# EAGLE schematic EEGFrontOnly (EAGLE 8.6.0)

## Sheet 1 of 3
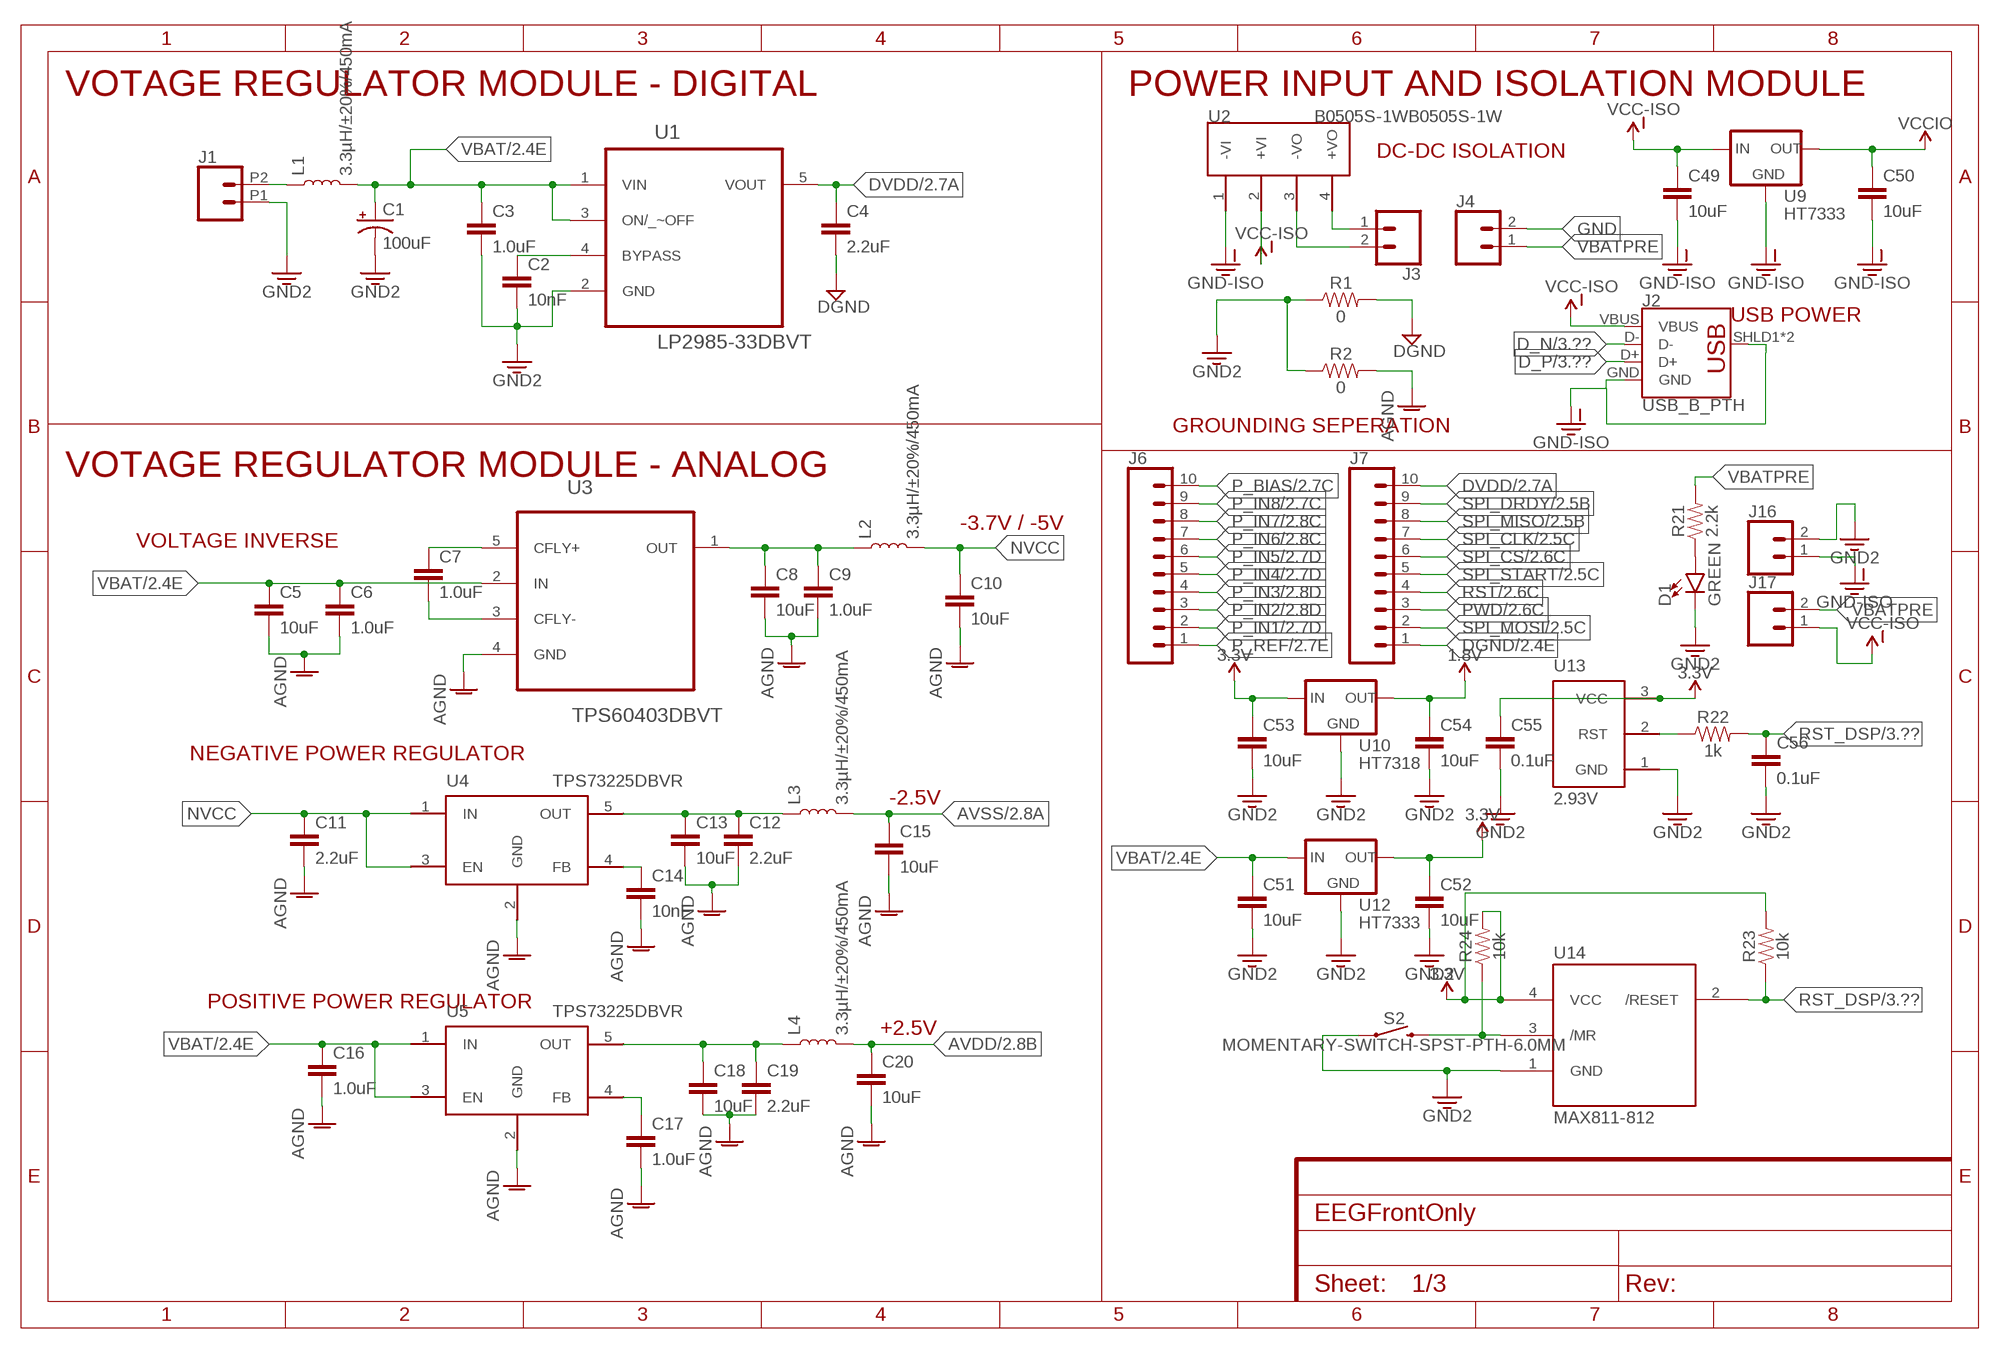
[diagram p0: schematic, sheet 1]

### Parts
C1  100uF  100UF-POLAR-RADIAL-2.5MM-25V-20%  [CPOL-RADIAL-2.5MM-6.5MM]
C2  10nF  10NF-0402-50V-10%  [0402]
C3  1.0uF  1.0UF-0402-16V-10%  [0402]
C4  2.2uF  2.2UF-0603-10V-20%  [0603]
C5  10uF  10UF-0603-6.3V-20%  [0603]
C6  1.0uF  1.0UF-0603-16V-10%  [0603]
C7  1.0uF  1.0UF-0402-16V-10%  [0402]
C8  10uF  10UF-0603-6.3V-20%  [0603]
C9  1.0uF  1.0UF-0603-16V-10%  [0603]
C10  10uF  10UF-0603-6.3V-20%  [0603]
C11  2.2uF  2.2UF-0603-10V-20%  [0603]
C12  2.2uF  2.2UF-0603-10V-20%  [0603]
C13  10uF  10UF-0603-6.3V-20%  [0603]
C14  10nF  10NF-0402-50V-10%  [0402]
C15  10uF  10UF-0603-6.3V-20%  [0603]
C16  1.0uF  1.0UF-0402-16V-10%  [0402]
C17  1.0uF  1.0UF-0402-16V-10%  [0402]
C18  10uF  10UF-0603-6.3V-20%  [0603]
C19  2.2uF  2.2UF-0603-10V-20%  [0603]
C20  10uF  10UF-0603-6.3V-20%  [0603]
C49  10uF  10UF-0603-6.3V-20%  [0603]
C50  10uF  10UF-0603-6.3V-20%  [0603]
C51  10uF  10UF-0603-6.3V-20%  [0603]
C52  10uF  10UF-0603-6.3V-20%  [0603]
C53  10uF  10UF-0603-6.3V-20%  [0603]
C54  10uF  10UF-0603-6.3V-20%  [0603]
C55  0.1uF  0.1UF-0402-16V-10%  [0402]
C56  0.1uF  0.1UF-0402-16V-10%  [0402]
D1  GREEN  LED-GREEN0603  [LED-0603]
J1  CONN_022.54MM_SCREWTERM  [1X02_2.54_SCREWTERM]
J2  USB_B_PTH  [USB-B-PTH]
J3  CONN_02  [1X02]
J4  CONN_02  [1X02]
J6  CONN_10"  [1X10]
J7  CONN_10"  [1X10]
J16  CONN_02  [1X02]
J17  CONN_02  [1X02]
L1  3.3µH/±20%/450mA  INDUCTOR-0805-3.3UH  [0805]
L2  3.3µH/±20%/450mA  INDUCTOR-0805-3.3UH  [0805]
L3  3.3µH/±20%/450mA  INDUCTOR-0805-3.3UH  [0805]
L4  3.3µH/±20%/450mA  INDUCTOR-0805-3.3UH  [0805]
R1  0  560OHM_0402_1%  [0402]
R2  0  560OHM_0402_1%  [0402]
R21  2.2k  2.2KOHM-0603-1/10W-1%  [0603]
R22  1k  1KOHM-0402-1%  [0402]
R23  10k  10KOHM-0402-1/10W-1%  [0402]
R24  10k  10KOHM-0402-1/10W-1%  [0402]
S2  MOMENTARY-SWITCH-SPST-PTH-6.0MM  [TACTILE_SWITCH_PTH_6.0MM]
U1  LP2985-33DBVT  [SOT95P280X145-5N]
U2  B0505S-1WB0505S-1W  [DIP4]
U3  TPS60403DBVT  [SOT95P280X145-5N]
U4  TPS73225DBVR  [SOT95P280X145-5N]
U5  TPS73225DBVR  [SOT95P280X145-5N]
U9  HT7333  [SOT-89]
U10  HT7318  [SOT-89]
U12  HT7333  [SOT-89]
U13  2.93V  IMP809SEUR-T  [SOT23-3]
U14  MAX811-812  [SOT143]

### Nets
1.8V: C54.1 U10.1(OUT) ; also sheet 3
3.3V: C52.1 C53.1 C55.1 R23.2 R24.2 U10.3(IN) U10.4(IN) U12.1(OUT) U13.3(VCC) U14.4(VCC) ; also sheet 3
AGND: C5.2 C6.2 C8.2 C9.2 C10.2 C11.2 C12.2 C13.2 C14.2 C15.2 C16.2 C17.2 C18.2 C19.2 C20.2 R2.2 U3.4(GND) U4.2(GND) U5.2(GND) ; also sheet 2
AVDD: C20.1 L4.2 ; also sheet 2
AVSS: C15.1 L3.2 ; also sheet 2
BYPASS: C2.1 U1.4(BYPASS)
D_N: J2.D- ; also sheet 3
D_P: J2.D+ ; also sheet 3
DGND: C4.2 J7.1 R1.2 ; also sheet 2
DVDD: C4.1 J7.10 U1.5(VOUT) ; also sheet 2
GND: C1.2(-) C2.2 C3.2 C51.2 C52.2 C53.2 C54.2 C55.2 C56.2 D1.C J1.P1 J4.2 J16.2 R1.1 R2.1 S2.1 U1.2(GND) U10.2(GND) U12.2(GND) U13.1(GND) U14.1(GND) ; supply symbol labelled GND2 ; also sheet 3
GND-ISO: C49.2 C50.2 J2.GND J2.SHLD1(SHIELD) J2.SHLD2(SHIELD) J16.1 U2.1(-VI) U9.2(GND) ; also sheet 3
N$1: J3.1 U2.4(+VO)
N$2: J3.2 U2.3(-VO)
N$3: C7.1 U3.5(CFLY+)
N$4: C7.2 U3.3(CFLY-)
N$5: C8.1 C9.1 L2.1 U3.1(OUT)
N$6: C17.1 U5.4(FB)
N$7: C12.1 C13.1 L3.1 U4.5(OUT)
N$8: C14.1 U4.4(FB)
N$9: C18.1 C19.1 L4.1 U5.5(OUT)
N$27: D1.A R21.1
N$28: R24.1 S2.3 U14.3(/MR)
N$29: R22.1 U13.2(RST)
NVCC: C10.1 C11.1 L2.2 U4.1(IN) U4.3(EN)
P_BIAS: J6.10 ; also sheet 2
P_IN1: J6.2 ; also sheet 2
P_IN2: J6.3 ; also sheet 2
P_IN3: J6.4 ; also sheet 2
P_IN4: J6.5 ; also sheet 2
P_IN5: J6.6 ; also sheet 2
P_IN6: J6.7 ; also sheet 2
P_IN7: J6.8 ; also sheet 2
P_IN8: J6.9 ; also sheet 2
P_REF: J6.1 ; also sheet 2
PWD: J7.3 ; also sheet 2,3
RST: J7.4 ; also sheet 2,3
RST_DSP: C56.1 R22.2 R23.1 U14.2(/RESET) ; also sheet 3
SPI_CLK: J7.7 ; also sheet 2,3
SPI_CS: J7.6 ; also sheet 2,3
SPI_DRDY: J7.9 ; also sheet 2,3
SPI_MISO: J7.8 ; also sheet 2,3
SPI_MOSI: J7.2 ; also sheet 2,3
SPI_START: J7.5 ; also sheet 2,3
VBAT: C1.1(+) C3.1 C5.1 C6.1 C16.1 C51.1 L1.2 U1.1(VIN) U1.3(ON/_~OFF) U3.2(IN) U5.1(IN) U5.3(EN) U12.3(IN) U12.4(IN) ; also sheet 2,3
VBATPRE: J1.P2 J4.1 J17.2 L1.1 R21.2
VCC-ISO: C49.1 J2.VBUS J17.1 U2.2(+VI) U9.3(IN) U9.4(IN) ; also sheet 3
VCCIO: C50.1 U9.1(OUT) ; also sheet 3

### Notes on the sheet
- VOTAGE REGULATOR MODULE - DIGITAL | POWER INPUT AND ISOLATION MODULE
- DC-DC ISOLATION
- USB POWER
- GROUNDING SEPERATION
- VOTAGE REGULATOR MODULE - ANALOG
- -3.7V / -5V
- VOLTAGE INVERSE
- NEGATIVE POWER REGULATOR
- -2.5V
- POSITIVE POWER REGULATOR
- +2.5V

## Sheet 2 of 3
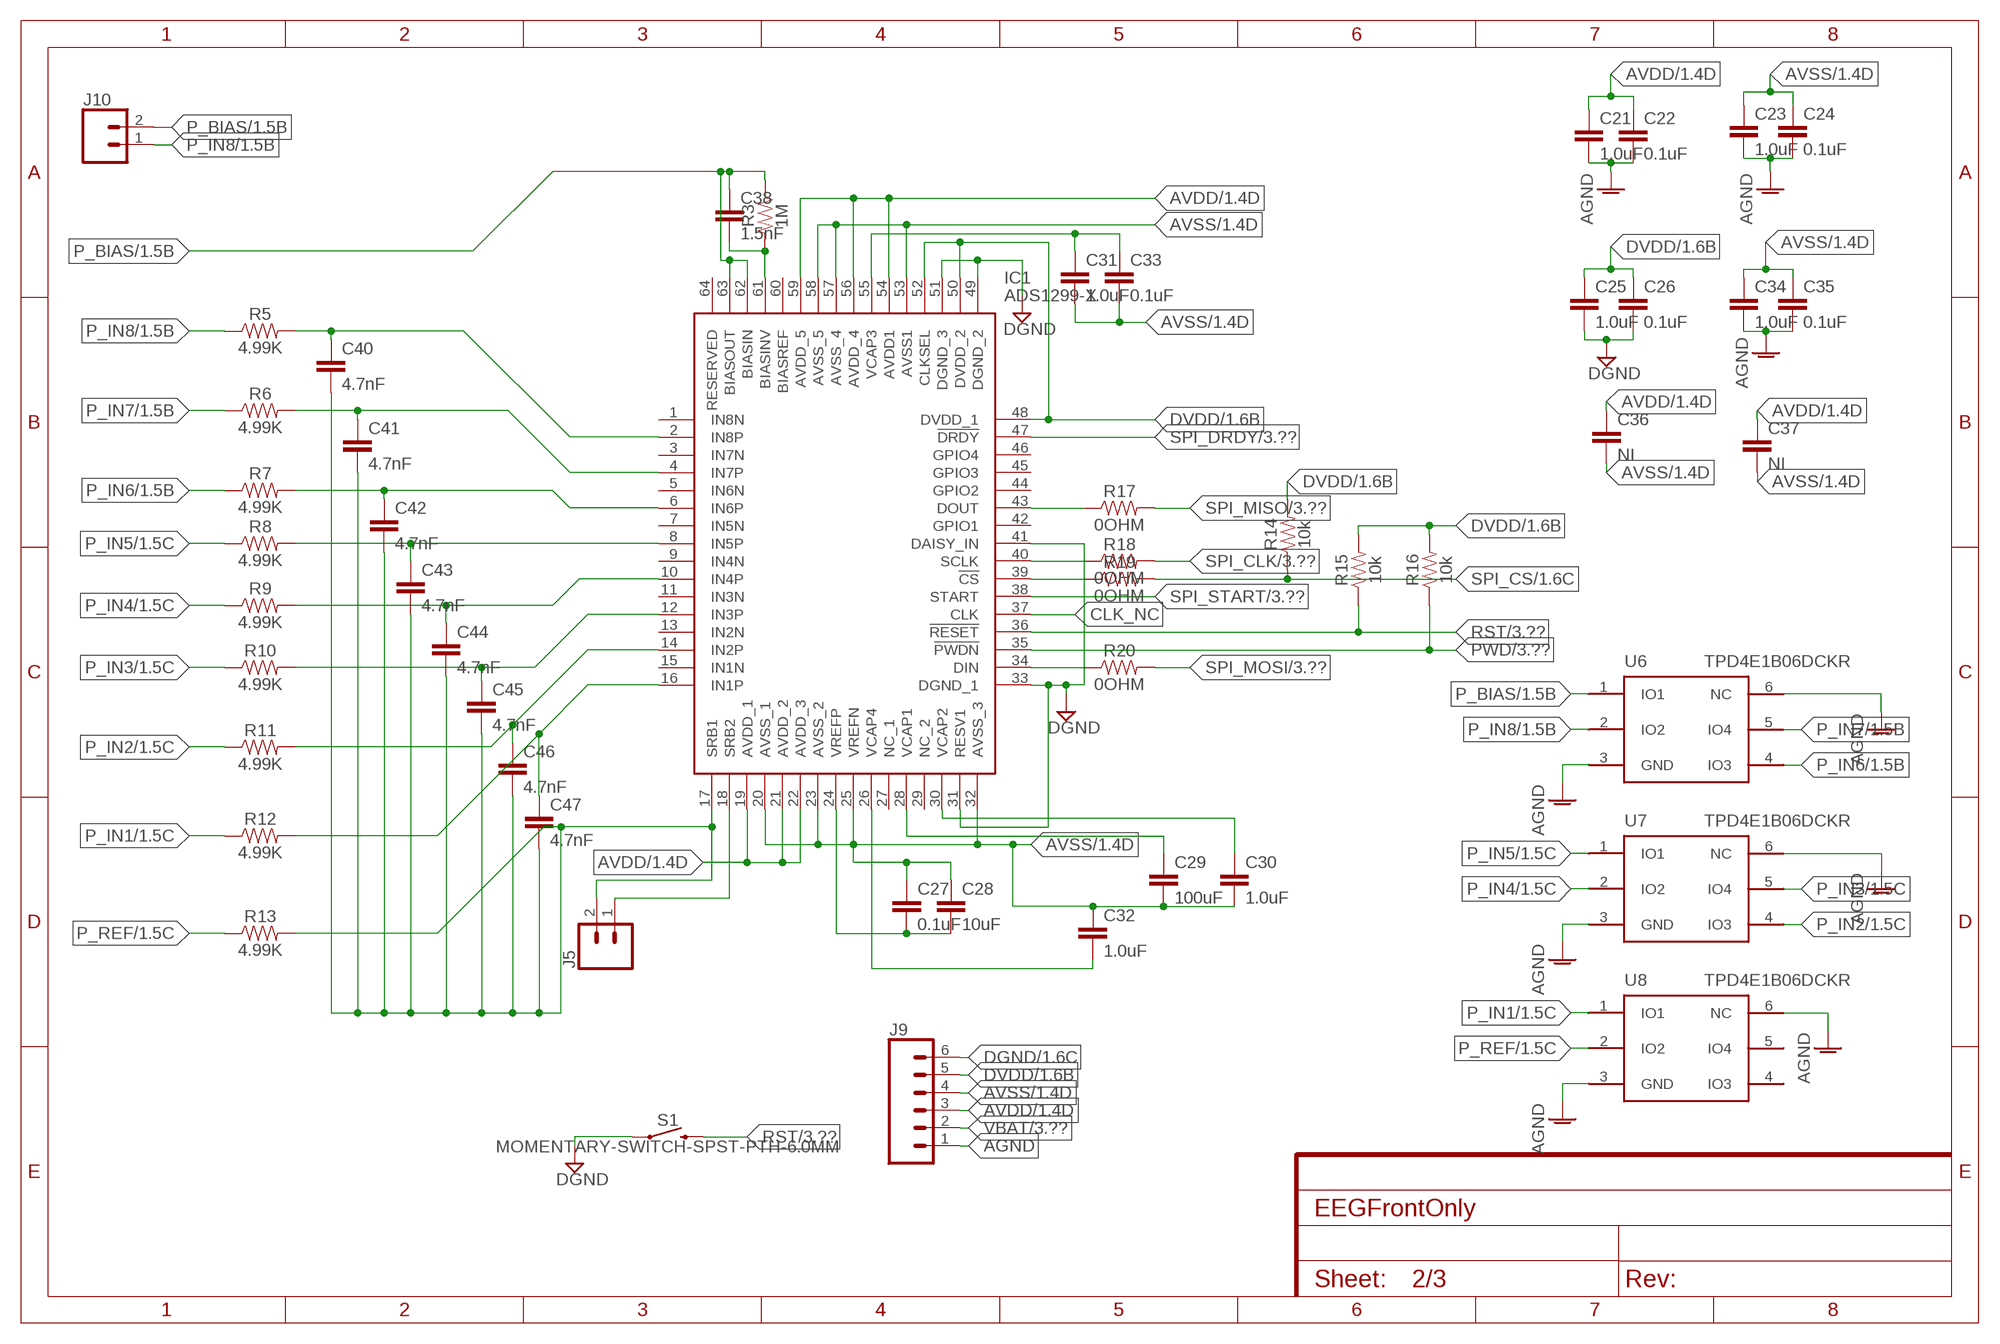
[diagram p1: schematic, sheet 2]

### Parts
C21  1.0uF  1.0UF-0402-16V-10%  [0402]
C22  0.1uF  0.1UF-0402-16V-10%  [0402]
C23  1.0uF  1.0UF-0402-16V-10%  [0402]
C24  0.1uF  0.1UF-0402-16V-10%  [0402]
C25  1.0uF  1.0UF-0402-16V-10%  [0402]
C26  0.1uF  0.1UF-0402-16V-10%  [0402]
C27  0.1uF  0.1UF-0402-16V-10%  [0402]
C28  10uF  10UF-0402-6.3V-20%  [0402]
C29  100uF  100UF-1210-20%-10V  [1210]
C30  1.0uF  1.0UF-0402-16V-10%  [0402]
C31  1.0uF  1.0UF-0402-16V-10%  [0402]
C32  1.0uF  1.0UF-0402-16V-10%  [0402]
C33  0.1uF  0.1UF-0402-16V-10%  [0402]
C34  1.0uF  1.0UF-0402-16V-10%  [0402]
C35  0.1uF  0.1UF-0402-16V-10%  [0402]
C36  NI  0.1UF-0402-16V-10%  [0402]
C37  NI  0.1UF-0402-16V-10%  [0402]
C38  1.5nF  1.5NF-0402  [0402]
C40  4.7nF  4.7NF-0402  [0402]
C41  4.7nF  4.7NF-0402  [0402]
C42  4.7nF  4.7NF-0402  [0402]
C43  4.7nF  4.7NF-0402  [0402]
C44  4.7nF  4.7NF-0402  [0402]
C45  4.7nF  4.7NF-0402  [0402]
C46  4.7nF  4.7NF-0402  [0402]
C47  4.7nF  4.7NF-0402  [0402]
IC1  ADS1299-X  [QFP50P1200X1200X120-64N]
J5  CONN_02  [1X02]
J9  CONN_06SILK_FEMALE_PTH  [1X06]
J10  CONN_02  [1X02]
R3  1M  1MOHM-0402-1/4W-5%  [0402]
R5  4.99K  4.99KOHM-0402  [0402]
R6  4.99K  4.99KOHM-0402  [0402]
R7  4.99K  4.99KOHM-0402  [0402]
R8  4.99K  4.99KOHM-0402  [0402]
R9  4.99K  4.99KOHM-0402  [0402]
R10  4.99K  4.99KOHM-0402  [0402]
R11  4.99K  4.99KOHM-0402  [0402]
R12  4.99K  4.99KOHM-0402  [0402]
R13  4.99K  4.99KOHM-0402  [0402]
R14  10k  10KOHM-0402-1/10W-1%  [0402]
R15  10k  10KOHM-0402-1/10W-1%  [0402]
R16  10k  10KOHM-0402-1/10W-1%  [0402]
R17  0OHM  [0402]
R18  0OHM  [0402]
R19  0OHM  [0402]
R20  0OHM  [0402]
S1  MOMENTARY-SWITCH-SPST-PTH-6.0MM  [TACTILE_SWITCH_PTH_6.0MM]
U6  TPD4E1B06DCKR  [SC70-6]
U7  TPD4E1B06DCKR  [SC70-6]
U8  TPD4E1B06DCKR  [SC70-6]

### Nets
AGND: C21.2 C22.2 C23.2 C24.2 C34.2 C35.2 J9.1 U6.3(GND) U6.6(NC) U7.3(GND) U7.6(NC) U8.3(GND) U8.6(NC) ; also sheet 1
AVDD: C21.1 C22.1 C36.1 C37.1 IC1.19(AVDD_1) IC1.21(AVDD_2) IC1.22(AVDD_3) IC1.54(AVDD1) IC1.56(AVDD_4) IC1.59(AVDD_5) J9.3 ; also sheet 1
AVSS: C23.1 C24.1 C27.1 C28.1 C29.2 C30.2 C31.2 C32.1 C33.2 C34.1 C35.1 C36.2 C37.2 IC1.20(AVSS_1) IC1.23(AVSS_2) IC1.25(VREFN) IC1.32(AVSS_3) IC1.53(AVSS1) IC1.57(AVSS_4) IC1.58(AVSS_5) J9.4 ; also sheet 1
CLK_NC: IC1.37(CLK)
DGND: C25.2 C26.2 IC1.31(RESV1) IC1.33(DGND_1) IC1.41(DAISY_IN) IC1.49(DGND_2) IC1.51(DGND_3) J9.6 S1.1 ; also sheet 1
DVDD: C25.1 C26.1 IC1.48(DVDD_1) IC1.50(DVDD_2) IC1.52(CLKSEL) J9.5 R14.2 R15.2 R16.2 ; also sheet 1
EEG_REF: C40.2 C41.2 C42.2 C43.2 C44.2 C45.2 C46.2 C47.2 IC1.17(SRB1) J5.2 R13.2
N$10: C27.2 C28.2 IC1.24(VREFP)
N$11: IC1.18(SRB2) J5.1
N$13: C38.2 IC1.61(BIASINV) R3.1
N$15: C40.1 IC1.2(IN8P) R5.2
N$16: C41.1 IC1.4(IN7P) R6.2
N$17: C42.1 IC1.6(IN6P) R7.2
N$18: C43.1 IC1.8(IN5P) R8.2
N$19: C44.1 IC1.10(IN4P) R9.2
N$20: C45.1 IC1.12(IN3P) R10.2
N$21: C46.1 IC1.14(IN2P) R11.2
N$22: C47.1 IC1.16(IN1P) R12.2
N$23: IC1.43(DOUT) R17.1
N$24: IC1.40(SCLK) R18.1
N$25: IC1.39(!CS) R19.1
N$26: IC1.34(DIN) R20.1
P_BIAS: C38.1 IC1.62(BIASIN) IC1.63(BIASOUT) J10.2 R3.2 U6.1(IO1) ; also sheet 1
P_IN1: R12.1 U8.1(IO1) ; also sheet 1
P_IN2: R11.1 U7.4(IO3) ; also sheet 1
P_IN3: R10.1 U7.5(IO4) ; also sheet 1
P_IN4: R9.1 U7.2(IO2) ; also sheet 1
P_IN5: R8.1 U7.1(IO1) ; also sheet 1
P_IN6: R7.1 U6.4(IO3) ; also sheet 1
P_IN7: R6.1 U6.5(IO4) ; also sheet 1
P_IN8: J10.1 R5.1 U6.2(IO2) ; also sheet 1
P_REF: R13.1 U8.2(IO2) ; also sheet 1
PWD: IC1.35(!PWDN) R16.1 ; also sheet 1,3
RST: IC1.36(!RESET) R15.1 S1.3 ; also sheet 1,3
SPI_CLK: R18.2 ; also sheet 1,3
SPI_CS: R14.1 R19.2 ; also sheet 1,3
SPI_DRDY: IC1.47(!DRDY) ; also sheet 1,3
SPI_MISO: R17.2 ; also sheet 1,3
SPI_MOSI: R20.2 ; also sheet 1,3
SPI_START: IC1.38(START) ; also sheet 1,3
VBAT: J9.2 ; also sheet 1,3
VCAP1: C29.1 IC1.28(VCAP1)
VCAP2: C30.1 IC1.30(VCAP2)
VCAP3: C31.1 C33.1 IC1.55(VCAP3)
VCAP4: C32.2 IC1.26(VCAP4)
Unconnected: IC1.1(IN8N) IC1.3(IN7N) IC1.5(IN6N) IC1.7(IN5N) IC1.9(IN4N) IC1.11(IN3N) IC1.13(IN2N) IC1.15(IN1N) IC1.27(NC_1) IC1.29(NC_2) IC1.42(GPIO1) IC1.44(GPIO2) IC1.45(GPIO3) IC1.46(GPIO4) IC1.60(BIASREF) IC1.64(RESERVED) U8.4(IO3) U8.5(IO4)

## Sheet 3 of 3
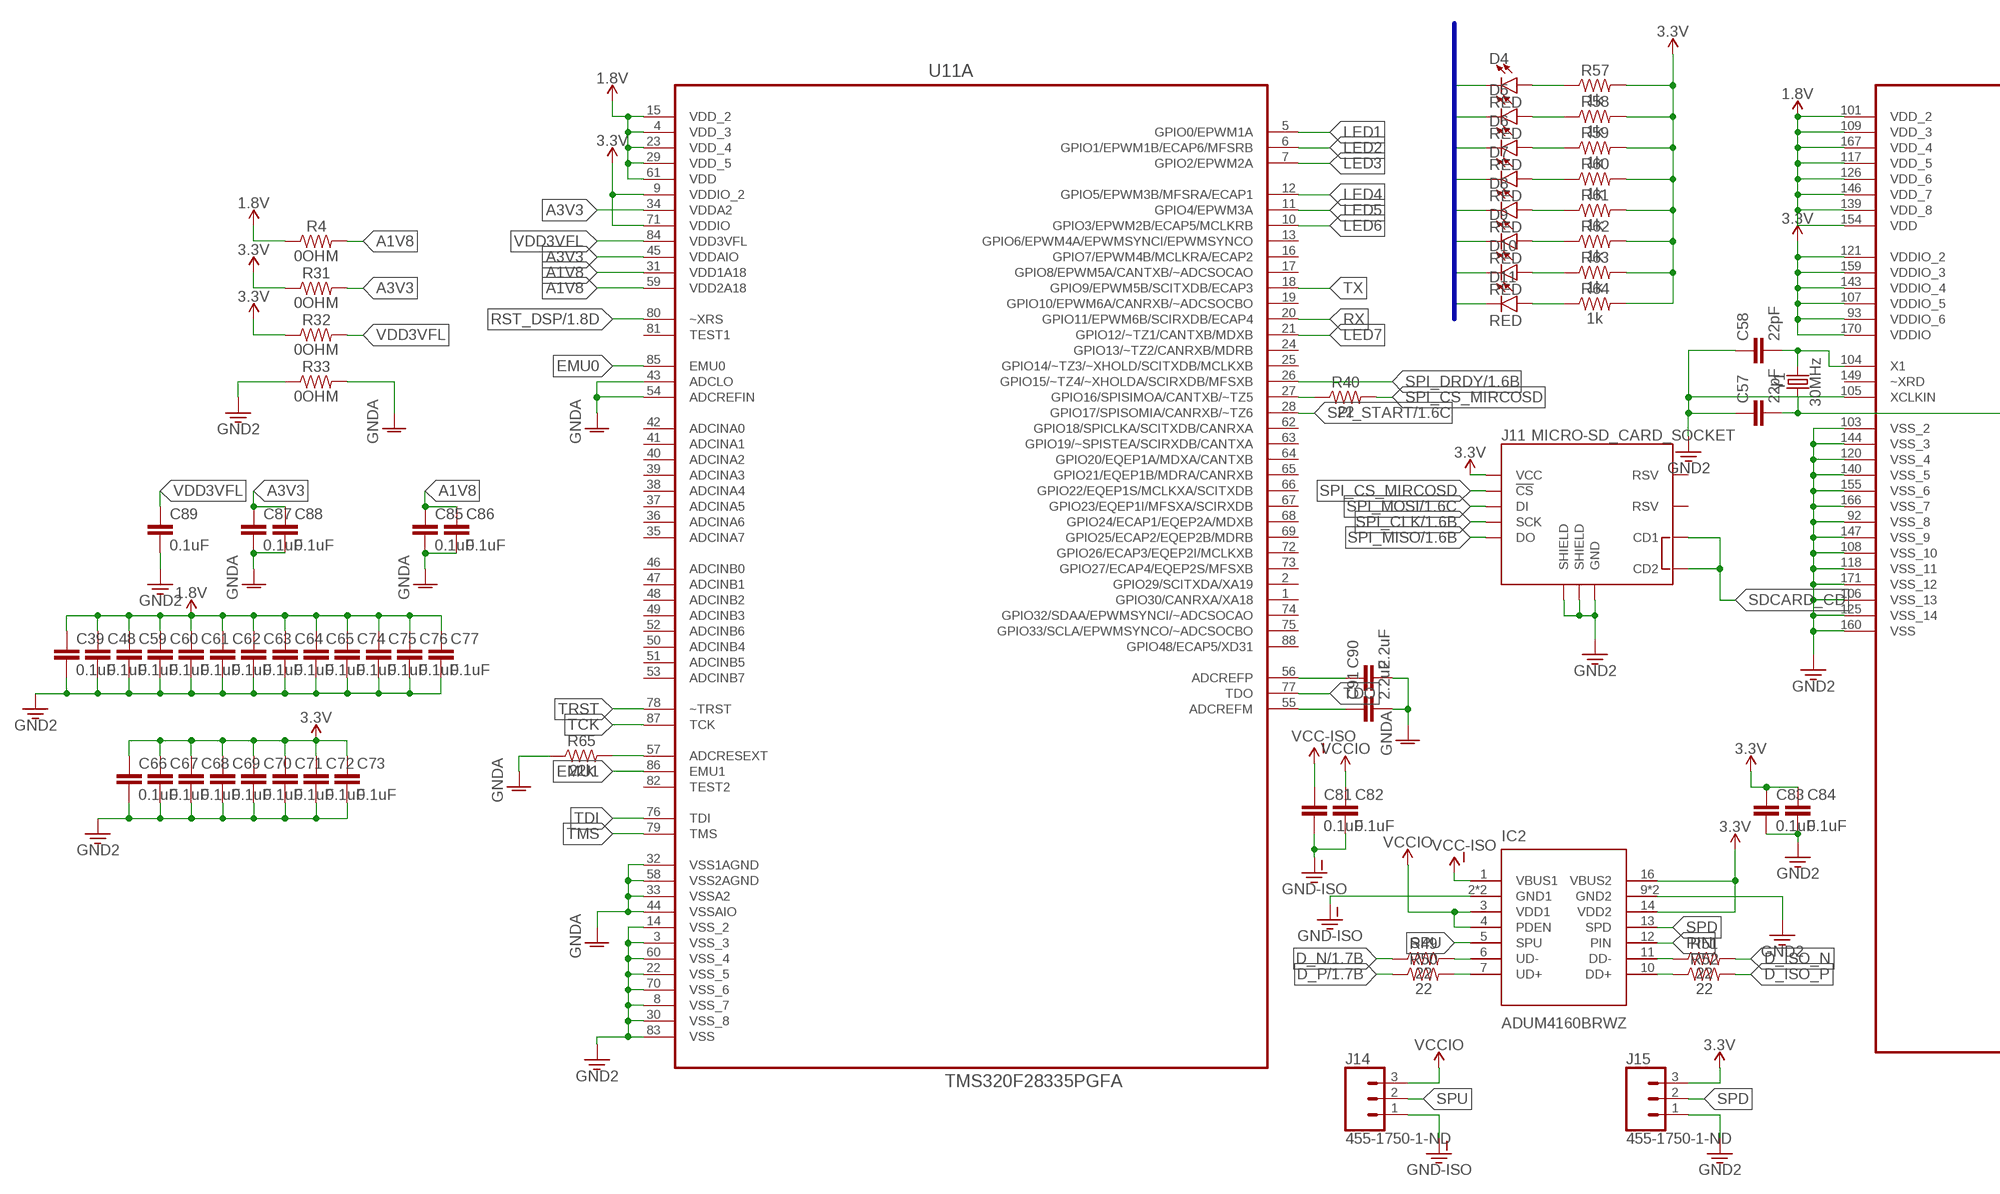
[diagram p2: schematic, sheet 3, part 1 of 2]
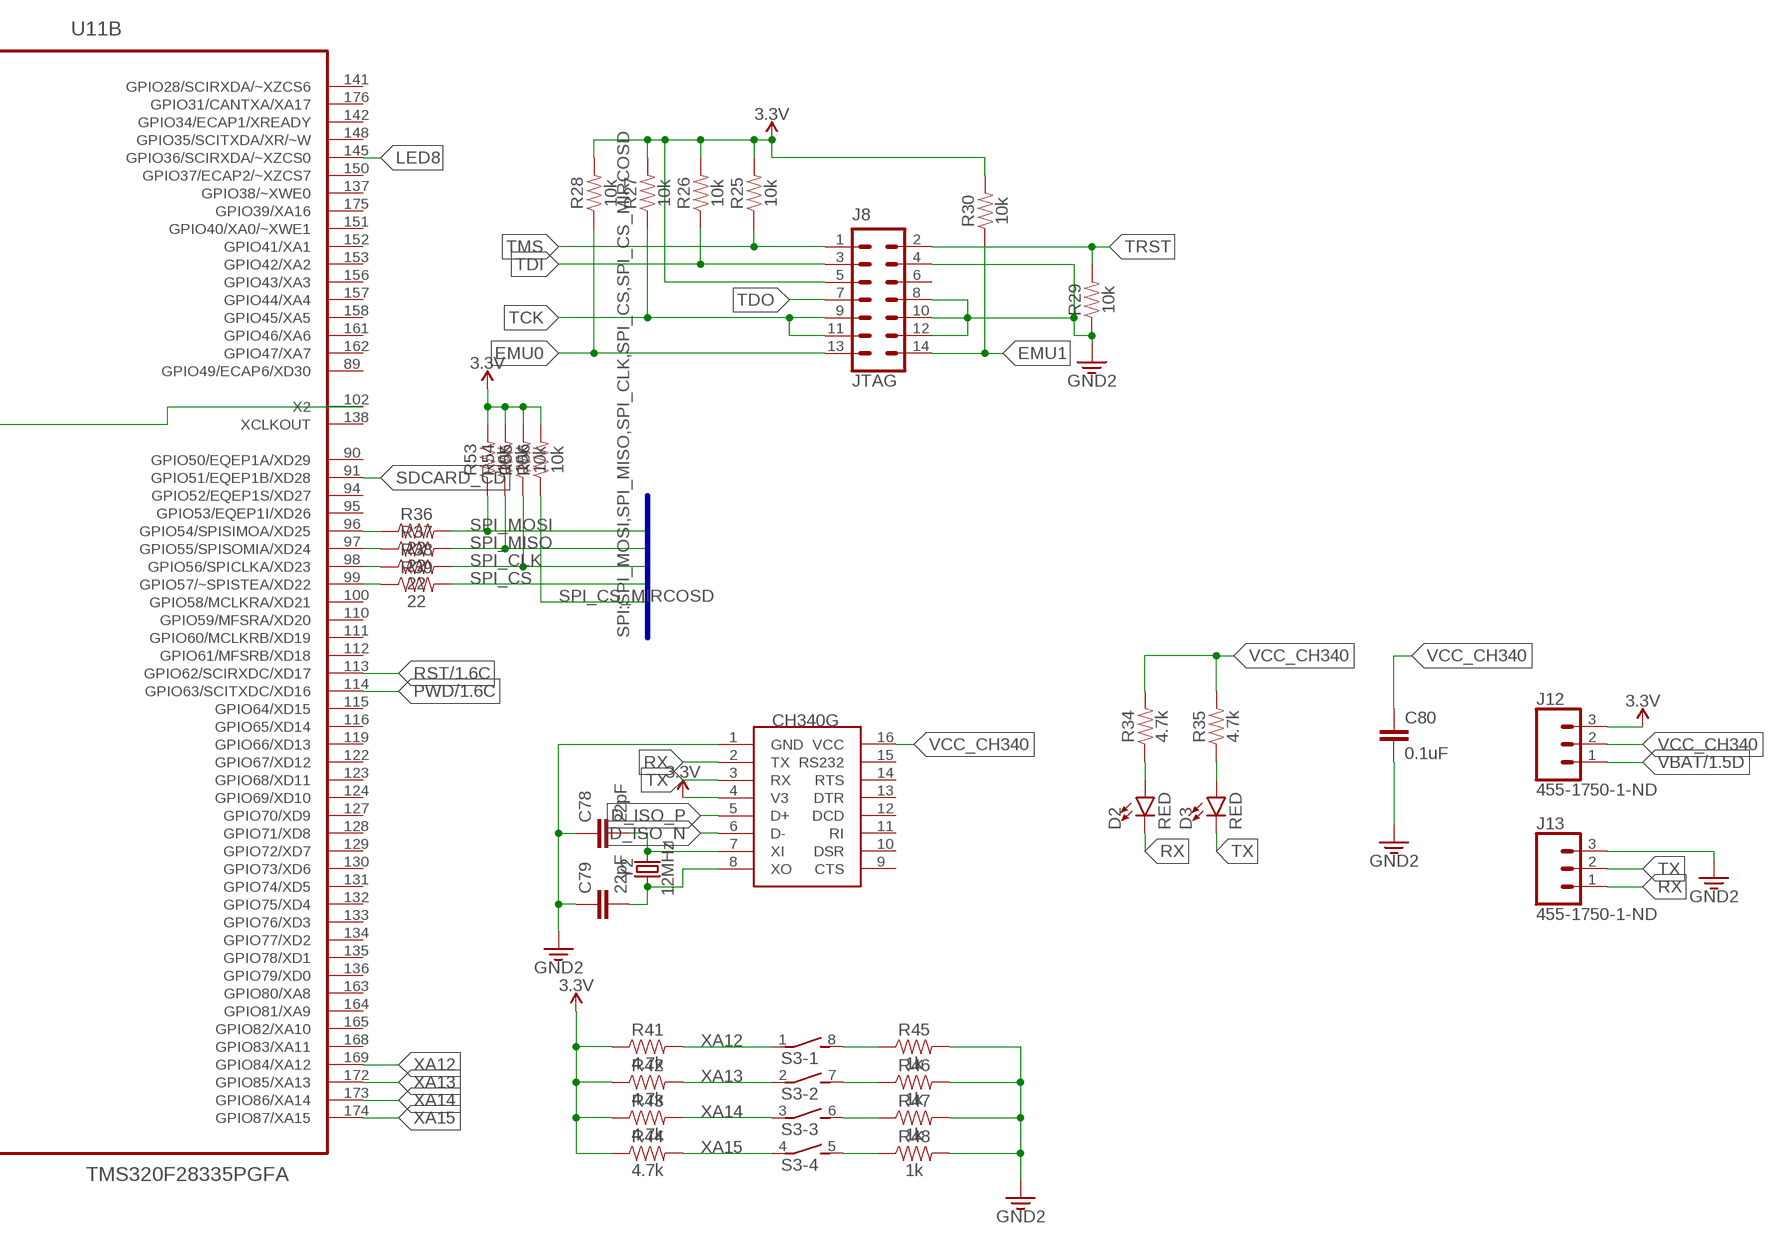
[diagram p3: schematic, sheet 3, part 2 of 2]

### Parts
C39  0.1uF  0.1UF-0402-16V-10%  [0402]
C48  0.1uF  0.1UF-0402-16V-10%  [0402]
C57  22pF  22PF-0402-50V-5%  [0402]
C58  22pF  22PF-0402-50V-5%  [0402]
C59  0.1uF  0.1UF-0402-16V-10%  [0402]
C60  0.1uF  0.1UF-0402-16V-10%  [0402]
C61  0.1uF  0.1UF-0402-16V-10%  [0402]
C62  0.1uF  0.1UF-0402-16V-10%  [0402]
C63  0.1uF  0.1UF-0402-16V-10%  [0402]
C64  0.1uF  0.1UF-0402-16V-10%  [0402]
C65  0.1uF  0.1UF-0402-16V-10%  [0402]
C66  0.1uF  0.1UF-0402-16V-10%  [0402]
C67  0.1uF  0.1UF-0402-16V-10%  [0402]
C68  0.1uF  0.1UF-0402-16V-10%  [0402]
C69  0.1uF  0.1UF-0402-16V-10%  [0402]
C70  0.1uF  0.1UF-0402-16V-10%  [0402]
C71  0.1uF  0.1UF-0402-16V-10%  [0402]
C72  0.1uF  0.1UF-0402-16V-10%  [0402]
C73  0.1uF  0.1UF-0402-16V-10%  [0402]
C74  0.1uF  0.1UF-0402-16V-10%  [0402]
C75  0.1uF  0.1UF-0402-16V-10%  [0402]
C76  0.1uF  0.1UF-0402-16V-10%  [0402]
C77  0.1uF  0.1UF-0402-16V-10%  [0402]
C78  22pF  22PF-0402-50V-5%  [0402]
C79  22pF  22PF-0402-50V-5%  [0402]
C80  0.1uF  0.1UF-0402-16V-10%  [0402]
C81  0.1uF  0.1UF-0402-16V-10%  [0402]
C82  0.1uF  0.1UF-0402-16V-10%  [0402]
C83  0.1uF  0.1UF-0402-16V-10%  [0402]
C84  0.1uF  0.1UF-0402-16V-10%  [0402]
C85  0.1uF  0.1UF-0402-16V-10%  [0402]
C86  0.1uF  0.1UF-0402-16V-10%  [0402]
C87  0.1uF  0.1UF-0402-16V-10%  [0402]
C88  0.1uF  0.1UF-0402-16V-10%  [0402]
C89  0.1uF  0.1UF-0402-16V-10%  [0402]
C90  2.2uF  2.2UF-0402-10V-20%  [0402]
C91  2.2uF  2.2UF-0402-10V-20%  [0402]
D2  RED  LED-RED0603  [LED-0603]
D3  RED  LED-RED0603  [LED-0603]
D4  RED  LED-RED0603  [LED-0603]
D5  RED  LED-RED0603  [LED-0603]
D6  RED  LED-RED0603  [LED-0603]
D7  RED  LED-RED0603  [LED-0603]
D8  RED  LED-RED0603  [LED-0603]
D9  RED  LED-RED0603  [LED-0603]
D10  RED  LED-RED0603  [LED-0603]
D11  RED  LED-RED0603  [LED-0603]
IC2  ADUM4160BRWZ  [SOIC127P1032X265-16N]
J8  JTAG  CONN_07X2  [2X7]
J11  MICRO-SD_CARD_SOCKET  [MICRO-SD-SOCKET]
J12  455-1750-1-ND  CONN_03  [1X03]
J13  455-1750-1-ND  CONN_03  [1X03]
J14  455-1750-1-ND  CONN_03  [1X03]
J15  455-1750-1-ND  CONN_03  [1X03]
R4  0OHM  [0402]
R25  10k  10KOHM-0402-1/10W-1%  [0402]
R26  10k  10KOHM-0402-1/10W-1%  [0402]
R27  10k  10KOHM-0402-1/10W-1%  [0402]
R28  10k  10KOHM-0402-1/10W-1%  [0402]
R29  10k  10KOHM-0402-1/10W-1%  [0402]
R30  10k  10KOHM-0402-1/10W-1%  [0402]
R31  0OHM  [0402]
R32  0OHM  [0402]
R33  0OHM  [0402]
R34  4.7k  4.7KOHM-0402-1/10W-1%  [0402]
R35  4.7k  4.7KOHM-0402-1/10W-1%  [0402]
R36  22  22OHM-0402-1/10W-1%  [0402]
R37  22  22OHM-0402-1/10W-1%  [0402]
R38  22  22OHM-0402-1/10W-1%  [0402]
R39  22  22OHM-0402-1/10W-1%  [0402]
R40  22  22OHM-0402-1/10W-1%  [0402]
R41  4.7k  4.7KOHM-0402-1/10W-1%  [0402]
R42  4.7k  4.7KOHM-0402-1/10W-1%  [0402]
R43  4.7k  4.7KOHM-0402-1/10W-1%  [0402]
R44  4.7k  4.7KOHM-0402-1/10W-1%  [0402]
R45  1k  1KOHM-0402-1%  [0402]
R46  1k  1KOHM-0402-1%  [0402]
R47  1k  1KOHM-0402-1%  [0402]
R48  1k  1KOHM-0402-1%  [0402]
R49  22  22OHM-0402-1/10W-1%  [0402]
R50  22  22OHM-0402-1/10W-1%  [0402]
R51  22  22OHM-0402-1/10W-1%  [0402]
R52  22  22OHM-0402-1/10W-1%  [0402]
R53  10k  10KOHM-0402-1/10W-1%  [0402]
R54  10k  10KOHM-0402-1/10W-1%  [0402]
R55  10k  10KOHM-0402-1/10W-1%  [0402]
R56  10k  10KOHM-0402-1/10W-1%  [0402]
R57  1k  1KOHM-0402-1%  [0402]
R58  1k  1KOHM-0402-1%  [0402]
R59  1k  1KOHM-0402-1%  [0402]
R60  1k  1KOHM-0402-1%  [0402]
R61  1k  1KOHM-0402-1%  [0402]
R62  1k  1KOHM-0402-1%  [0402]
R63  1k  1KOHM-0402-1%  [0402]
R64  1k  1KOHM-0402-1%  [0402]
R65  22k  22KOHM0402-1/10W-1%  [0402]
S3  DIP04S  [DIP04S]
U11  TMS320F28335PGFA  [QFP50P2600X2600X160-176N]
U$3  CH340G  [SOIC16]
Y1  30MHz  CRYSTALSMD-3.2X2.5  [CRYSTAL-SMD-3.2X2.5MM]
Y2  12MHz  CRYSTALSMD-3.2X2.5  [CRYSTAL-SMD-3.2X2.5MM]

### Nets
1.8V: C39.1 C48.1 C59.1 C60.1 C61.1 C62.1 C63.1 C64.1 C65.1 C74.1 C75.1 C76.1 C77.1 R4.1 U11.4(A:VDD_3) U11.15(A:VDD_2) U11.23(A:VDD_4) U11.29(A:VDD_5) U11.61(A:VDD) U11.101(B:VDD_2) U11.109(B:VDD_3) U11.117(B:VDD_5) U11.126(B:VDD_6) U11.139(B:VDD_8) U11.146(B:VDD_7) U11.154(B:VDD) U11.167(B:VDD_4) ; also sheet 1
3.3V: C66.1 C67.1 C68.1 C69.1 C70.1 C71.1 C72.1 C73.1 C83.1 C84.1 IC2.14(VDD2) IC2.16(VBUS2) J8.5 J11.VCC J12.3 J15.3 R25.2 R26.2 R27.2 R28.2 R30.2 R31.1 R32.1 R41.1 R42.1 R43.1 R44.1 R53.2 R54.2 R55.2 R56.2 R57.2 R58.2 R59.2 R60.2 R61.2 R62.2 R63.2 R64.2 U11.9(A:VDDIO_2) U11.71(A:VDDIO) U11.93(B:VDDIO_6) U11.107(B:VDDIO_5) U11.121(B:VDDIO_2) U11.143(B:VDDIO_4) U11.159(B:VDDIO_3) U11.170(B:VDDIO) U$3.4(V3) ; also sheet 1
A1V8: C85.1 C86.1 R4.2 U11.31(A:VDD1A18) U11.59(A:VDD2A18)
A3V3: C87.1 C88.1 R31.2 U11.34(A:VDDA2) U11.45(A:VDDAIO)
D_ISO_N: R51.2 U$3.6(D-)
D_ISO_P: R52.2 U$3.5(D+)
D_ISO_PRE_N: IC2.11(DD-) R51.1
D_ISO_PRE_P: IC2.10(DD+) R52.1
D_N: R49.1 ; also sheet 1
D_P: R50.1 ; also sheet 1
EMU0: J8.13 R28.1 U11.85(A:EMU0)
EMU1: J8.14 R30.1 U11.86(A:EMU1)
GND: C39.2 C48.2 C57.1 C58.1 C59.2 C60.2 C61.2 C62.2 C63.2 C64.2 C65.2 C66.2 C67.2 C68.2 C69.2 C70.2 C71.2 C72.2 C73.2 C74.2 C75.2 C76.2 C77.2 C78.1 C79.1 C80.2 C83.2 C84.2 C89.2 IC2.9(GND2) IC2.15(GND2) J8.4 J8.8 J8.10 J8.12 J11.GND J11.GND1(SHIELD) J11.GND3(SHIELD) J13.3 J15.1 R29.1 R33.1 R45.2 R46.2 R47.2 R48.2 U11.3(A:VSS_3) U11.8(A:VSS_7) U11.14(A:VSS_2) U11.22(A:VSS_5) U11.30(A:VSS_8) U11.60(A:VSS_4) U11.70(A:VSS_6) U11.83(A:VSS) U11.92(B:VSS_8) U11.103(B:VSS_2) U11.105(B:XCLKIN) U11.106(B:VSS_13) U11.108(B:VSS_10) U11.118(B:VSS_11) U11.120(B:VSS_4) U11.125(B:VSS_14) U11.140(B:VSS_5) U11.144(B:VSS_3) U11.147(B:VSS_9) U11.155(B:VSS_6) U11.160(B:VSS) U11.166(B:VSS_7) U11.171(B:VSS_12) U$3.1(GND) ; supply symbol labelled GND2 ; also sheet 1
GND-ISO: C81.2 C82.2 IC2.2(GND1) IC2.8(GND1) J14.1 ; also sheet 1
GNDA: C85.2 C86.2 C87.2 C88.2 C90.2 C91.2 R33.2 R65.1 U11.32(A:VSS1AGND) U11.33(A:VSSA2) U11.43(A:ADCLO) U11.44(A:VSSAIO) U11.54(A:ADCREFIN) U11.58(A:VSS2AGND)
LED1: D4.C U11.5(A:GPIO0/EPWM1A)
LED2: D5.C U11.6(A:GPIO1/EPWM1B/ECAP6/MFSRB)
LED3: D6.C U11.7(A:GPIO2/EPWM2A)
LED4: D7.C U11.12(A:GPIO5/EPWM3B/MFSRA/ECAP1)
LED5: D8.C U11.11(A:GPIO4/EPWM3A)
LED6: D9.C U11.10(A:GPIO3/EPWM2B/ECAP5/MCLKRB)
LED7: D10.C U11.21(A:GPIO12/~TZ1/CANTXB/MDXB)
LED8: D11.C U11.145(B:GPIO36/SCIRXDA/~XZCS0)
N$12: C78.2 U$3.7(XI) Y2.3
N$14: C79.2 U$3.8(XO) Y2.1
N$30: C58.2 U11.104(B:X1) Y1.3
N$31: C57.2 U11.102(B:X2) Y1.1
N$32: D11.A R64.1
N$33: D2.A R34.1
N$34: D3.A R35.1
N$35: R36.1 U11.96(B:GPIO54/SPISIMOA/XD25)
N$36: IC2.6(UD-) R49.2
N$37: R37.1 U11.97(B:GPIO55/SPISOMIA/XD24)
N$38: R38.1 U11.98(B:GPIO56/SPICLKA/XD23)
N$39: R39.1 U11.99(B:GPIO57/~SPISTEA/XD22)
N$40: R40.1 U11.27(A:GPIO16/SPISIMOA/CANTXB/~TZ5)
N$41: IC2.7(UD+) R50.2
N$42: D10.A R63.1
N$43: D9.A R62.1
N$44: D8.A R61.1
N$45: D7.A R60.1
N$46: D6.A R59.1
N$47: D5.A R58.1
N$48: D4.A R57.1
N$49: C90.1 U11.56(A:ADCREFP)
N$50: C91.1 U11.55(A:ADCREFM)
N$51: R65.2 U11.57(A:ADCRESEXT)
N$54: R48.1 S3.5
N$55: R47.1 S3.6
N$56: R46.1 S3.7
N$57: R45.1 S3.8
PIN: IC2.12(PIN)
PWD: U11.114(B:GPIO63/SCITXDC/XD16) ; also sheet 1,2
RST: U11.113(B:GPIO62/SCIRXDC/XD17) ; also sheet 1,2
RST_DSP: U11.80(A:~XRS) ; also sheet 1
RX: D2.C J13.1 U11.20(A:GPIO11/EPWM6B/SCIRXDB/ECAP4) U$3.2(TX)
SDCARD_CD: J11.CD1 J11.CD2 U11.91(B:GPIO51/EQEP1B/XD28)
SPD: IC2.13(SPD) J15.2
SPI_CLK: J11.SCLK(SCK) R38.2 R55.1 ; also sheet 1,2
SPI_CS: R39.2 ; also sheet 1,2
SPI_CS_MIRCOSD: J11.CS(!CS) R40.2 R56.1
SPI_DRDY: U11.26(A:GPIO15/~TZ4/~XHOLDA/SCIRXDB/MFSXB) ; also sheet 1,2
SPI_MISO: J11.DO R37.2 R54.1 ; also sheet 1,2
SPI_MOSI: J11.DI R36.2 R53.1 ; also sheet 1,2
SPI_START: U11.28(A:GPIO17/SPISOMIA/CANRXB/~TZ6) ; also sheet 1,2
SPU: IC2.5(SPU) J14.2
TCK: J8.9 J8.11 R27.1 U11.87(A:TCK)
TDI: J8.3 R26.1 U11.76(A:TDI)
TDO: J8.7 U11.77(A:TDO)
TMS: J8.1 R25.1 U11.79(A:TMS)
TRST: J8.2 R29.2 U11.78(A:~TRST)
TX: D3.C J13.2 U11.18(A:GPIO9/EPWM5B/SCITXDB/ECAP3) U$3.3(RX)
VBAT: J12.1 ; also sheet 1,2
VCC-ISO: C81.1 IC2.1(VBUS1) ; also sheet 1
VCC_CH340: C80.1 J12.2 R34.2 R35.2 U$3.16(VCC)
VCCIO: C82.1 IC2.3(VDD1) IC2.4(PDEN) J14.3 ; also sheet 1
VDD3VFL: C89.1 R32.2 U11.84(A:VDD3VFL)
XA12: R41.2 S3.1 U11.169(B:GPIO84/XA12)
XA13: R42.2 S3.2 U11.172(B:GPIO85/XA13)
XA14: R43.2 S3.3 U11.173(B:GPIO86/XA14)
XA15: R44.2 S3.4 U11.174(B:GPIO87/XA15)
Unconnected: J8.6 J11.RSV1(RSV) J11.RSV2(RSV) U11.1(A:GPIO30/CANRXA/XA18) U11.2(A:GPIO29/SCITXDA/XA19) U11.13(A:GPIO6/EPWM4A/EPWMSYNCI/EPWMSYNCO) U11.16(A:GPIO7/EPWM4B/MCLKRA/ECAP2) U11.17(A:GPIO8/EPWM5A/CANTXB/~ADCSOCAO) U11.19(A:GPIO10/EPWM6A/CANRXB/~ADCSOCBO) U11.24(A:GPIO13/~TZ2/CANRXB/MDRB) U11.25(A:GPIO14/~TZ3/~XHOLD/SCITXDB/MCLKXB) U11.35(A:ADCINA7) U11.36(A:ADCINA6) U11.37(A:ADCINA5) U11.38(A:ADCINA4) U11.39(A:ADCINA3) U11.40(A:ADCINA2) U11.41(A:ADCINA1) U11.42(A:ADCINA0) U11.46(A:ADCINB0) U11.47(A:ADCINB1) U11.48(A:ADCINB2) U11.49(A:ADCINB3) U11.50(A:ADCINB4) U11.51(A:ADCINB5) U11.52(A:ADCINB6) U11.53(A:ADCINB7) U11.62(A:GPIO18/SPICLKA/SCITXDB/CANRXA) U11.63(A:GPIO19/~SPISTEA/SCIRXDB/CANTXA) U11.64(A:GPIO20/EQEP1A/MDXA/CANTXB) U11.65(A:GPIO21/EQEP1B/MDRA/CANRXB) U11.66(A:GPIO22/EQEP1S/MCLKXA/SCITXDB) U11.67(A:GPIO23/EQEP1I/MFSXA/SCIRXDB) U11.68(A:GPIO24/ECAP1/EQEP2A/MDXB) U11.69(A:GPIO25/ECAP2/EQEP2B/MDRB) U11.72(A:GPIO26/ECAP3/EQEP2I/MCLKXB) U11.73(A:GPIO27/ECAP4/EQEP2S/MFSXB) U11.74(A:GPIO32/SDAA/EPWMSYNCI/~ADCSOCAO) U11.75(A:GPIO33/SCLA/EPWMSYNCO/~ADCSOCBO) U11.81(A:TEST1) U11.82(A:TEST2) U11.88(A:GPIO48/ECAP5/XD31) U11.89(B:GPIO49/ECAP6/XD30) U11.90(B:GPIO50/EQEP1A/XD29) U11.94(B:GPIO52/EQEP1S/XD27) U11.95(B:GPIO53/EQEP1I/XD26) U11.100(B:GPIO58/MCLKRA/XD21) U11.110(B:GPIO59/MFSRA/XD20) U11.111(B:GPIO60/MCLKRB/XD19) U11.112(B:GPIO61/MFSRB/XD18) U11.115(B:GPIO64/XD15) U11.116(B:GPIO65/XD14) U11.119(B:GPIO66/XD13) U11.122(B:GPIO67/XD12) U11.123(B:GPIO68/XD11) U11.124(B:GPIO69/XD10) U11.127(B:GPIO70/XD9) U11.128(B:GPIO71/XD8) U11.129(B:GPIO72/XD7) U11.130(B:GPIO73/XD6) U11.131(B:GPIO74/XD5) U11.132(B:GPIO75/XD4) U11.133(B:GPIO76/XD3) U11.134(B:GPIO77/XD2) U11.135(B:GPIO78/XD1) U11.136(B:GPIO79/XD0) U11.137(B:GPIO38/~XWE0) U11.138(B:XCLKOUT) U11.141(B:GPIO28/SCIRXDA/~XZCS6) U11.142(B:GPIO34/ECAP1/XREADY) U11.148(B:GPIO35/SCITXDA/XR/~W) U11.149(B:~XRD) U11.150(B:GPIO37/ECAP2/~XZCS7) U11.151(B:GPIO40/XA0/~XWE1) U11.152(B:GPIO41/XA1) U11.153(B:GPIO42/XA2) U11.156(B:GPIO43/XA3) U11.157(B:GPIO44/XA4) U11.158(B:GPIO45/XA5) U11.161(B:GPIO46/XA6) U11.162(B:GPIO47/XA7) U11.163(B:GPIO80/XA8) U11.164(B:GPIO81/XA9) U11.165(B:GPIO82/XA10) U11.168(B:GPIO83/XA11) U11.175(B:GPIO39/XA16) U11.176(B:GPIO31/CANTXA/XA17) U$3.9(CTS) U$3.10(DSR) U$3.11(RI) U$3.12(DCD) U$3.13(DTR) U$3.14(RTS) U$3.15(RS232)

### Buses
SPI:SPI_MOSI,SPI_MISO,SPI_CLK,SPI_CS,SPI_CS_MIRCOSD
LED_BUS:LED1,LED2,LED3,LED4,LED5,LED6,LED7,LED8

## Library data of the parts
C1 = SparkFun-Capacitors:100UF-POLAR: 100µF polarized capacitors A capacitor is a passive two-terminal electrical component used to store electrical energy temporarily in an electric field.; PROD_ID: CAP-08439
C2 C14 = SparkFun-Capacitors:10NF: 0.01uF/10nF/10,000pF ceramic capacitors A capacitor is a passive two-terminal electrical component used to store electrical energy temporarily in an electric field. CAP-09321
C3 C7 C16 C17 C21 C23 C25 C30-C32 C34 = SparkFun-Capacitors:1.0UF: 1µF ceramic capacitors A capacitor is a passive two-terminal electrical component used to store electrical energy temporarily in an electric field.; PROD_ID: CAP-12417
C4 C11 C12 C19 = SparkFun-Capacitors:2.2UF: 2.2µF ceramic capacitors A capacitor is a passive two-terminal electrical component used to store electrical energy temporarily in an electric field.; PROD_ID: CAP-07888
C5 C8 C10 C13 C15 C18 C20 C49-C54 = SparkFun-Capacitors:10UF: 10.0µF ceramic capacitors A capacitor is a passive two-terminal electrical component used to store electrical energy temporarily in an electric field.; PROD_ID: CAP-11015
C6 C9 = SparkFun-Capacitors:1.0UF: 1µF ceramic capacitors A capacitor is a passive two-terminal electrical component used to store electrical energy temporarily in an electric field.; PROD_ID: CAP-00868
C22 C24 C26 C27 C33 C35 C39 C48 C55 C56 C59-C77 C80-C89 = SparkFun-Capacitors:0.1UF: 0.1µF ceramic capacitors A capacitor is a passive two-terminal electrical component used to store electrical energy temporarily in an electric field.; PROD_ID: CAP-12416
C28 = SparkFun-Capacitors:10UF: 10.0µF ceramic capacitors A capacitor is a passive two-terminal electrical component used to store electrical energy temporarily in an electric field.
C29 = jingjieparts:100UF
C36 C37 = SparkFun-Capacitors:0.1UF: 0.1µF ceramic capacitors A capacitor is a passive two-terminal electrical component used to store electrical energy temporarily in an electric field.; PROD_ID: CAP-12416; VALUE: 0.1uF
C38 = SparkFun-Capacitors:1.5NF
C40-C47 = SparkFun-Capacitors:4.7NF
C57 C58 C78 C79 = SparkFun-Capacitors:22PF: 22pF ceramic capacitors A capacitor is a passive two-terminal electrical component used to store electrical energy temporarily in an electric field.
C90 C91 = SparkFun-Capacitors:2.2UF: 2.2µF ceramic capacitors A capacitor is a passive two-terminal electrical component used to store electrical energy temporarily in an electric field.
D1 = SparkFun-LED:LED-GREEN: Green SMD LED Used in manufacturing of various products at SparkFun Packages: 0603 - SMD 0603 package [Product Link] <http://www.futureelectronics.com/en/technologies/semiconductors/optoelectronics/leds/Pages/9894312-LTST-C190GKT.aspx?CrossPart=HSMG-C190&IM=0> LilyPad 1206 - SMD1206 LilyPad package [Product Link] <http://www.futureelectronics.com/en/Technologies/Product.aspx?ProductID=IN150NGHARVATEKCORPORATION2049943&IM=0> 1206 - SMD1206 package [Product Link] <http://www.futureelectronics.com/en/technologies/semiconductors/optoelectronics/leds/Pages/8315665-LTST-C150KGKT.aspx?IM=0> 1206 Bottom Mount -SMD 1206 Bottom Mount [Product Link] <http://www.digikey.com/product-detail/en/lite-on-inc/LTST-C230KGKT/160-1456-1-ND/386854> SparkFun Products: Pro Mini 328 -5V <https://www.sparkfun.com/products/821> RedBoard <https://www.sparkfun.com/products/12757> MP3 Trigger <https://www.sparkfun.com/products/13720> Makey Makey <https://www.sparkfun.com/products/11076>; PROD_ID: DIO-00821
D2-D11 = SparkFun-LED:LED-RED: Red SMD LED Used in manufacturing of most products at SparkFun Packages: 0603 - SMD 0603 package [Product Link] <http://docs.avagotech.com/docs/AV02-0551EN> 0603 SMART - SMD 0603 SMART package ( more efficient and expensive)[Product Link] <http://www.osram-os.com/Graphics/XPic2/00077099_0.pdf> 1206 - SMD1206 package [Product Link] <https://www.sparkfun.com/datasheets/DevTools/LilyPad/Q150OVS4.pdff> SparkFun Products: Pro Mini 328 -5V <https://www.sparkfun.com/products/821> RedBoard <https://www.sparkfun.com/products/12757> IOIO-OTG <https://www.sparkfun.com/products/13613>; PROD_ID: DIO-00819
IC1 = ADS1299-X:ADS1299-X: ADS1299-x 24-Bit Analog-to-Digital Converters (ADCs) Source: Datasheet <http://www.ti.com/lit/ds/symlink/ads1299.pdf>; DESCRIPTION: ADS1299-x 24-Bit Analog-to-Digital Converters (ADCs); HEIGHT: 1.2mm; MANUFACTURER_NAME: Texas Instruments; MANUFACTURER_PART_NUMBER: ADS1299-X
IC2 = SOIC127P1032X265-16N:ADUM4160
J1 J3-J5 J10 J16 J17 = SparkFun-Connectors:CONN_02: Multi connection point. Often used as Generic Header-pin footprint for 0.1 inch spaced/style header connections On any of the 0.1 inch spaced packages, you can populate with these: Break Away Headers - Straight <https://www.sparkfun.com/products/116> (PRT-00116) Break Away Male Headers - Right Angle <https://www.sparkfun.com/products/553> (PRT-00553) Female Headers <https://www.sparkfun.com/products/115> (PRT-00115) Break Away Headers - Machine Pin <https://www.sparkfun.com/products/117> (PRT-00117) Break Away Female Headers - Swiss Machine Pin <https://www.sparkfun.com/products/743> (PRT-00743) For SCREWTERMINALS and SPRING TERMINALS visit here: Screw Terimnals on SparkFun.com <https://www.sparkfun.com/search/results?term=Screw+Terminals> (5mm/3.5mm/2.54mm spacing) This device is also useful as a general connection point to wire up your design to another part of your project. Our various solder wires solder well into these plated through hole pads. Hook-Up Wire - Assortment (Stranded, 22 AWG) <https://www.sparkfun.com/products/11375> (PRT-11375) Hook-Up Wire - Assortment (Solid Core, 22 AWG) <https://www.sparkfun.com/products/11367> (PRT-11367) View the entire wire category on our website here <https://www.sparkfun.com/categories/141> Special notes: Molex polarized connector foot print use with: PRT-08233 with associated crimp pins and housings. 2.54_SCREWTERM for use with PRT-10571. 3.5mm Screw Terminal footprints for PRT-08084 5mm Screw Terminal footprints for use with PRT-08432
J2 = SparkFun-Connectors:USB_B: USB Type B Connector SparkFun Products: SparkFun Stepoko <https://www.sparkfun.com/products/13899> PTH; PROD_ID: CONN-08278; SF_ID: PRT-00139
J6 J7 = SparkFun-Connectors:CONN_10: Multi connection point. Often used as Generic Header-pin footprint for 0.1 inch spaced/style header connections On any of the 0.1 inch spaced packages, you can populate with these: Break Away Headers - Straight <https://www.sparkfun.com/products/116> (PRT-00116) Break Away Male Headers - Right Angle <https://www.sparkfun.com/products/553> (PRT-00553) Female Headers <https://www.sparkfun.com/products/115> (PRT-00115) Break Away Headers - Machine Pin <https://www.sparkfun.com/products/117> (PRT-00117) Break Away Female Headers - Swiss Machine Pin <https://www.sparkfun.com/products/743> (PRT-00743) Arduino Stackable Header - 10 Pin <https://www.sparkfun.com/products/11376> (PRT-11376) For SCREWTERMINALS and SPRING TERMINALS visit here: Screw Terimnals on SparkFun.com <https://www.sparkfun.com/search/results?term=Screw+Terminals> (5mm/3.5mm/2.54mm spacing) This device is also useful as a general connection point to wire up your design to another part of your project. Our various solder wires solder well into these plated through hole pads. Hook-Up Wire - Assortment (Stranded, 22 AWG) <https://www.sparkfun.com/products/11375> (PRT-11375) Hook-Up Wire - Assortment (Solid Core, 22 AWG) <https://www.sparkfun.com/products/11367> (PRT-11367) View the entire wire category on our website here <https://www.sparkfun.com/categories/141> Special notes: Molex polarized connector foot print use with SKU : PRT-08231 with associated crimp pins and housings. 1MM SMD Version SKU: PRT-10208 NOTES ON THE VARIANTS LOCK and LOCK_LONGPADS... This footprint was designed to help hold the alignment of a through-hole component (i.e. 6-pin header) while soldering it into place. You may notice that each hole has been shifted either up or down by 0.005 of an inch from it's more standard position (which is a perfectly straight line). This slight alteration caused the pins (the squares in the middle) to touch the edges of the holes. Because they are alternating, it causes a "brace" to hold the component in place. 0.005 has proven to be the perfect amount of "off-center" position when using our standard breakaway headers. Although looks a little odd when you look at the bare footprint, once you have a header in there, the alteration is very hard to notice. Also,if you push a header all the way into place, it is covered up entirely on the bottom side.; PROD_ID: CONN-11563
J8 = SparkFun-Connectors:CONN_07X2
J9 = SparkFun-Connectors:CONN_06: Multi connection point. Often used as Generic Header-pin footprint for 0.1 inch spaced/style header connections On any of the 0.1 inch spaced packages, you can populate with these: Break Away Headers - Straight <https://www.sparkfun.com/products/116> (PRT-00116) Break Away Male Headers - Right Angle <https://www.sparkfun.com/products/553> (PRT-00553) Female Headers <https://www.sparkfun.com/products/115> (PRT-00115) Break Away Headers - Machine Pin <https://www.sparkfun.com/products/117> (PRT-00117) Break Away Female Headers - Swiss Machine Pin <https://www.sparkfun.com/products/743> (PRT-00743) Arduino Stackable Header - 6 Pin <https://www.sparkfun.com/products/9280> (PRT-09280) For SCREWTERMINALS and SPRING TERMINALS visit here: Screw Terimnals on SparkFun.com <https://www.sparkfun.com/search/results?term=Screw+Terminals> (5mm/3.5mm/2.54mm spacing) This device is also useful as a general connection point to wire up your design to another part of your project. Our various solder wires solder well into these plated through hole pads. Hook-Up Wire - Assortment (Stranded, 22 AWG) <https://www.sparkfun.com/products/11375> (PRT-11375) Hook-Up Wire - Assortment (Solid Core, 22 AWG) <https://www.sparkfun.com/products/11367> (PRT-11367) View the entire wire category on our website here <https://www.sparkfun.com/categories/141>; PROD_ID: CONN-08437
J11 = SparkFun-Connectors:MICRO-SD_CARD_SOCKET: microSD Socket for Transflash Push-push type µSD socket. tDoc lines correctly indicate media card edge positions when inserting (unlocked, locked, depressed). NOTE: CD1 and CD2 are connected internally, and the default detect state of the socket is detect pin to ground. SparkFun Products: WAV Trigger <https://www.sparkfun.com/products/13660> CAN-Bus Shield <https://www.sparkfun.com/products/13262> SparkFun Level Shifing microSD Breakout <https://www.sparkfun.com/products/13743>; PROD_ID: CONN-07820; SF_ID: PRT-00127
J12-J15 = SparkFun-Connectors:CONN_03: Multi connection point. Often used as Generic Header-pin footprint for 0.1 inch spaced/style header connections On any of the 0.1 inch spaced packages, you can populate with these: Break Away Headers - Straight <https://www.sparkfun.com/products/116> (PRT-00116) Break Away Male Headers - Right Angle <https://www.sparkfun.com/products/553> (PRT-00553) Female Headers <https://www.sparkfun.com/products/115> (PRT-00115) Break Away Headers - Machine Pin <https://www.sparkfun.com/products/117> (PRT-00117) Break Away Female Headers - Swiss Machine Pin <https://www.sparkfun.com/products/743> (PRT-00743) Stackable Header - 3 Pin (Female, 0.1") <https://www.sparkfun.com/products/13875> (PRT-13875) For SCREWTERMINALS and SPRING TERMINALS visit here: Screw Terimnals on SparkFun.com <https://www.sparkfun.com/search/results?term=Screw+Terminals> (5mm/3.5mm/2.54mm spacing) This device is also useful as a general connection point to wire up your design to another part of your project. Our various solder wires solder well into these plated through hole pads. Hook-Up Wire - Assortment (Stranded, 22 AWG) <https://www.sparkfun.com/products/11375> (PRT-11375) Hook-Up Wire - Assortment (Solid Core, 22 AWG) <https://www.sparkfun.com/products/11367> (PRT-11367) View the entire wire category on our website here <https://www.sparkfun.com/categories/141> Special notes: Molex polarized connector foot print use with SKU : PRT-08232 with associated crimp pins and housings.; PROD_ID: XXX-00000
L1-L4 = SparkFun-Coils:INDUCTOR: Inductors Resist changes in electrical current. Basically a coil of wire. SparkFun Products: SparkFun Load Cell Amplifier - HX711 <https://www.sparkfun.com/products/13879> IOIO-OTG - V2.2 <https://www.sparkfun.com/products/13613>; PROD_ID: NDUC-13076
R1 R2 = SparkFun-Resistors:560OHM; PROD_ID: RES-13766; VALUE: 560
R3 = SparkFun-Resistors:1MOHM: 1MΩ resistor A resistor is a passive two-terminal electrical component that implements electrical resistance as a circuit element. Resistors act to reduce current flow, and, at the same time, act to lower voltage levels within circuits. - Wikipedia; PROD_ID: C26083
R4 R17-R20 R31-R33 = SparkFun-Resistors:0OHM: 0Ω resistor A resistor is a passive two-terminal electrical component that implements electrical resistance as a circuit element. Resistors act to reduce current flow, and, at the same time, act to lower voltage levels within circuits. - Wikipedia
R5-R13 = SparkFun-Resistors:4.99KOHM
R14-R16 R23-R30 R53-R56 = SparkFun-Resistors:10KOHM: 10kΩ resistor A resistor is a passive two-terminal electrical component that implements electrical resistance as a circuit element. Resistors act to reduce current flow, and, at the same time, act to lower voltage levels within circuits. - Wikipedia
R21 = SparkFun-Resistors:2.2KOHM: 2.2kΩ resistor A resistor is a passive two-terminal electrical component that implements electrical resistance as a circuit element. Resistors act to reduce current flow, and, at the same time, act to lower voltage levels within circuits. - Wikipedia; PROD_ID: RES-08272
R22 R45-R48 R57-R64 = SparkFun-Resistors:1KOHM: 1kΩ resistor A resistor is a passive two-terminal electrical component that implements electrical resistance as a circuit element. Resistors act to reduce current flow, and, at the same time, act to lower voltage levels within circuits. - Wikipedia
R34 R35 R41-R44 = SparkFun-Resistors:4.7KOHM: 4.7kΩ resistor A resistor is a passive two-terminal electrical component that implements electrical resistance as a circuit element. Resistors act to reduce current flow, and, at the same time, act to lower voltage levels within circuits. - Wikipedia
R36-R40 R49-R52 = SparkFun-Resistors:22OHM: 22Ω resistor A resistor is a passive two-terminal electrical component that implements electrical resistance as a circuit element. Resistors act to reduce current flow, and, at the same time, act to lower voltage levels within circuits. - Wikipedia; PROD_ID: RES-12427
R65 = SparkFun-Resistors:22KOHM: 22kΩ resistor A resistor is a passive two-terminal electrical component that implements electrical resistance as a circuit element. Resistors act to reduce current flow, and, at the same time, act to lower voltage levels within circuits. - Wikipedia
S1 S2 = SparkFun-Switches:MOMENTARY-SWITCH-SPST: Momentary Switch (Pushbutton) - SPST Normally-open (NO) SPST momentary switches (buttons, pushbuttons). Variants PTH-12MM - 12mm square, through-hole Momentary Pushbutton Switch - 12mm Square <https://www.sparkfun.com/products/9190> (COM-09190) PTH-6.0MM, PTH-6.0MM-KIT - 6.0mm square, through-hole Mini Pushbutton Switch <https://www.sparkfun.com/products/97> (COM-00097) KIT package intended for soldering kit's - only one side of pads' copper is exposed. PTH-RIGHT-ANGLE-KIT - Right-angle, through-hole Right Angle Tactile Button <https://www.sparkfun.com/products/10791> - Used on SparkFun BigTime Watch Kit <https://www.sparkfun.com/products/11734> SMD-12MM - 12mm square, surface-mount Tactile Button - SMD (12mm) <https://www.sparkfun.com/products/12993> (COM-12993) Used on SparkFun PicoBoard <https://www.sparkfun.com/products/11888> SMD-4.5MM - 4.5mm Square Trackball Switch Used on SparkFun Blackberry Trackballer Breakout <https://www.sparkfun.com/products/13169> SMD-4.6MMX2.8MM - 4.60mm x 2.80mm, surface mount Used on SparkFun SAMD21 Mini Breakout <https://www.sparkfun.com/products/13664> SMD-5.2MM, SMD-5.2-REDUNDANT - 5.2mm square, surface-mount Mini Pushbutton Switch - SMD <https://www.sparkfun.com/products/8720> (COM-08720) Used on Arduino Pro Mini <https://www.sparkfun.com/products/11114> REDUNDANT package connects both switch circuits together SMD-6.0X3.5MM - 6.0 x 3.5mm, surface mount Momentary Reset Switch SMD <https://www.sparkfun.com/products/8229> (COM-08229) SMD-6.2MM-TALL - 6.2mm square, surface mount Tactile Button - SMD (6mm) <https://www.sparkfun.com/products/12992> Used on SparkFun Digital Sandbox <https://www.sparkfun.com/products/12651> SMD-RIGHT-ANGLE - Right-angle, surface mount Used on SparkFun Block for Intel® Edison - Arduino <https://www.sparkfun.com/products/13036>; PROD_ID: SWCH-08441; SF_SKU: COM-00097
S3 = switch-dil:DIP04S: DIL/CODE SWITCH; OC_FARNELL: unknown; OC_NEWARK: unknown
U1 = Texas Instruments_By_element14_Batch_1:LP2985-33DBVT: 150-mA LOW-NOISE LOW-DROPOUT REGULATOR WITH SHUTDOWN; MPN: LP2985-33DBVT; OC_FARNELL: -; OC_NEWARK: 43J9347; PACKAGE: SOT-23-5; SUPPLIER: Texas Instruments
U2 = jingjieparts:B0505S-1W
U3 = Texas Instruments_By_element14_Batch_1:TPS60403DBVT: Unregulated 60 mA Charge pump voltage Inverter; MPN: TPS60403DBVT; OC_FARNELL: 8457786; OC_NEWARK: 77C0632; PACKAGE: SOT-23-5; SUPPLIER: Texas Instruments
U4 U5 = jingjieparts:TPS73225
U6-U8 = jingjieparts:TPD4E1B06
U9 U10 U12 = holtek2:HT73*
U11 = Texas Instruments_By_element14_Batch_1:TMS320F28335PGFA: Digital Signal Controllers; MPN: TMS320F28335PGFA; OC_FARNELL: 1901870; OC_NEWARK: 11N7235; PACKAGE: QFP-176; SUPPLIER: TEXAS INSTRUMENTS
U13 = jingjieparts:IMP809S
U14 = m-pad-2.1:MAX811-812: MAX811/MAX812 4-Pin µP Voltage Monitors with Manual Reset Input General Description The MAX811/MAX812 are low-power microprocessor (µP) supervisory circuits used to monitor power supplies in µP and digital systems. They provide excellent circuit reliability and low cost by eliminating external components and adjustments when used with 5Vpowered or 3V-powered circuits. The MAX811/MAX812 also provide a debounced manual reset input. These devices perform a single function: They assert a reset signal whenever the VCC supply voltage falls below a preset threshold, keeping it asserted for at least 140ms after VCC has risen above the reset threshold. The only difference between the two devices is that the MAX811 has an active-low RESET output (which is guaranteed to be in the correct state for VCC down to 1V), while the MAX812 has an active-high RESET output. The reset comparator is designed to ignore fast transients on VCC. Reset thresholds are available for operation with a variety of supply voltages. Low supply current makes the MAX811/MAX812 ideal for use in portable equipment. The devices come in a 4-pin SOT143 package. Features Precision Monitoring of 3V, 3.3V, and 5V Power-Supply Voltages 6µA Supply Current 140ms Min Power-On Reset Pulse Width; RESET Output (MAX811), RESET Output (MAX812) Guaranteed Over Temperature Guaranteed RESET Valid to VCC = 1V (MAX811) Power-Supply Transient Immunity No External Components 4-Pin SOT143 Package Applications Computers Controllers Intelligent Instruments Critical µP and µC Power Monitoring Portable/Battery-Powered Equipment Please send any comments to: messi@users.sourceforge.net
U$3 = ch340g:CH340G
Y1 Y2 = SparkFun-Clocks:CRYSTAL: Crystals (Generic) These are passive quartz crystals, which can be used as a clock source for a microcontroller. Crystal's are two-terminal devices. They require external "load" capacitors to generate an oscillating signal.